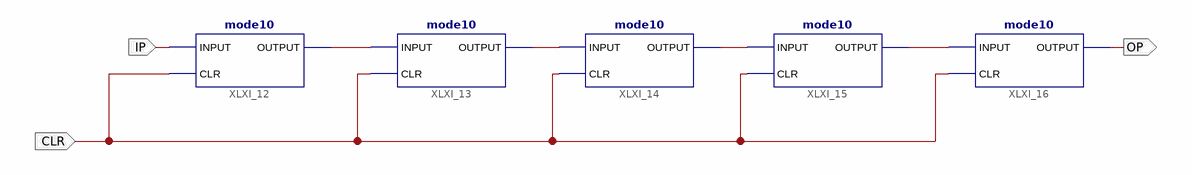
[diagram p0: schematic sheet 1]
// Xilinx ISE schematic div100k.sch (spartan6) as structural Verilog: 5 symbols, 3 ports
module div100k (
  input  IP,
  input  CLR,
  output OP
);

  wire XLXN_10, XLXN_11, XLXN_12, XLXN_13;

  mode10 XLXI_12 (.INPUT(IP), .OUTPUT(XLXN_10), .CLR(CLR));
  mode10 XLXI_13 (.INPUT(XLXN_10), .OUTPUT(XLXN_11), .CLR(CLR));
  mode10 XLXI_14 (.INPUT(XLXN_11), .OUTPUT(XLXN_12), .CLR(CLR));
  mode10 XLXI_15 (.INPUT(XLXN_12), .OUTPUT(XLXN_13), .CLR(CLR));
  mode10 XLXI_16 (.INPUT(XLXN_13), .OUTPUT(OP), .CLR(CLR));
endmodule
